# EAGLE design Shield_SEN100T_v4 (EAGLE 5.11)
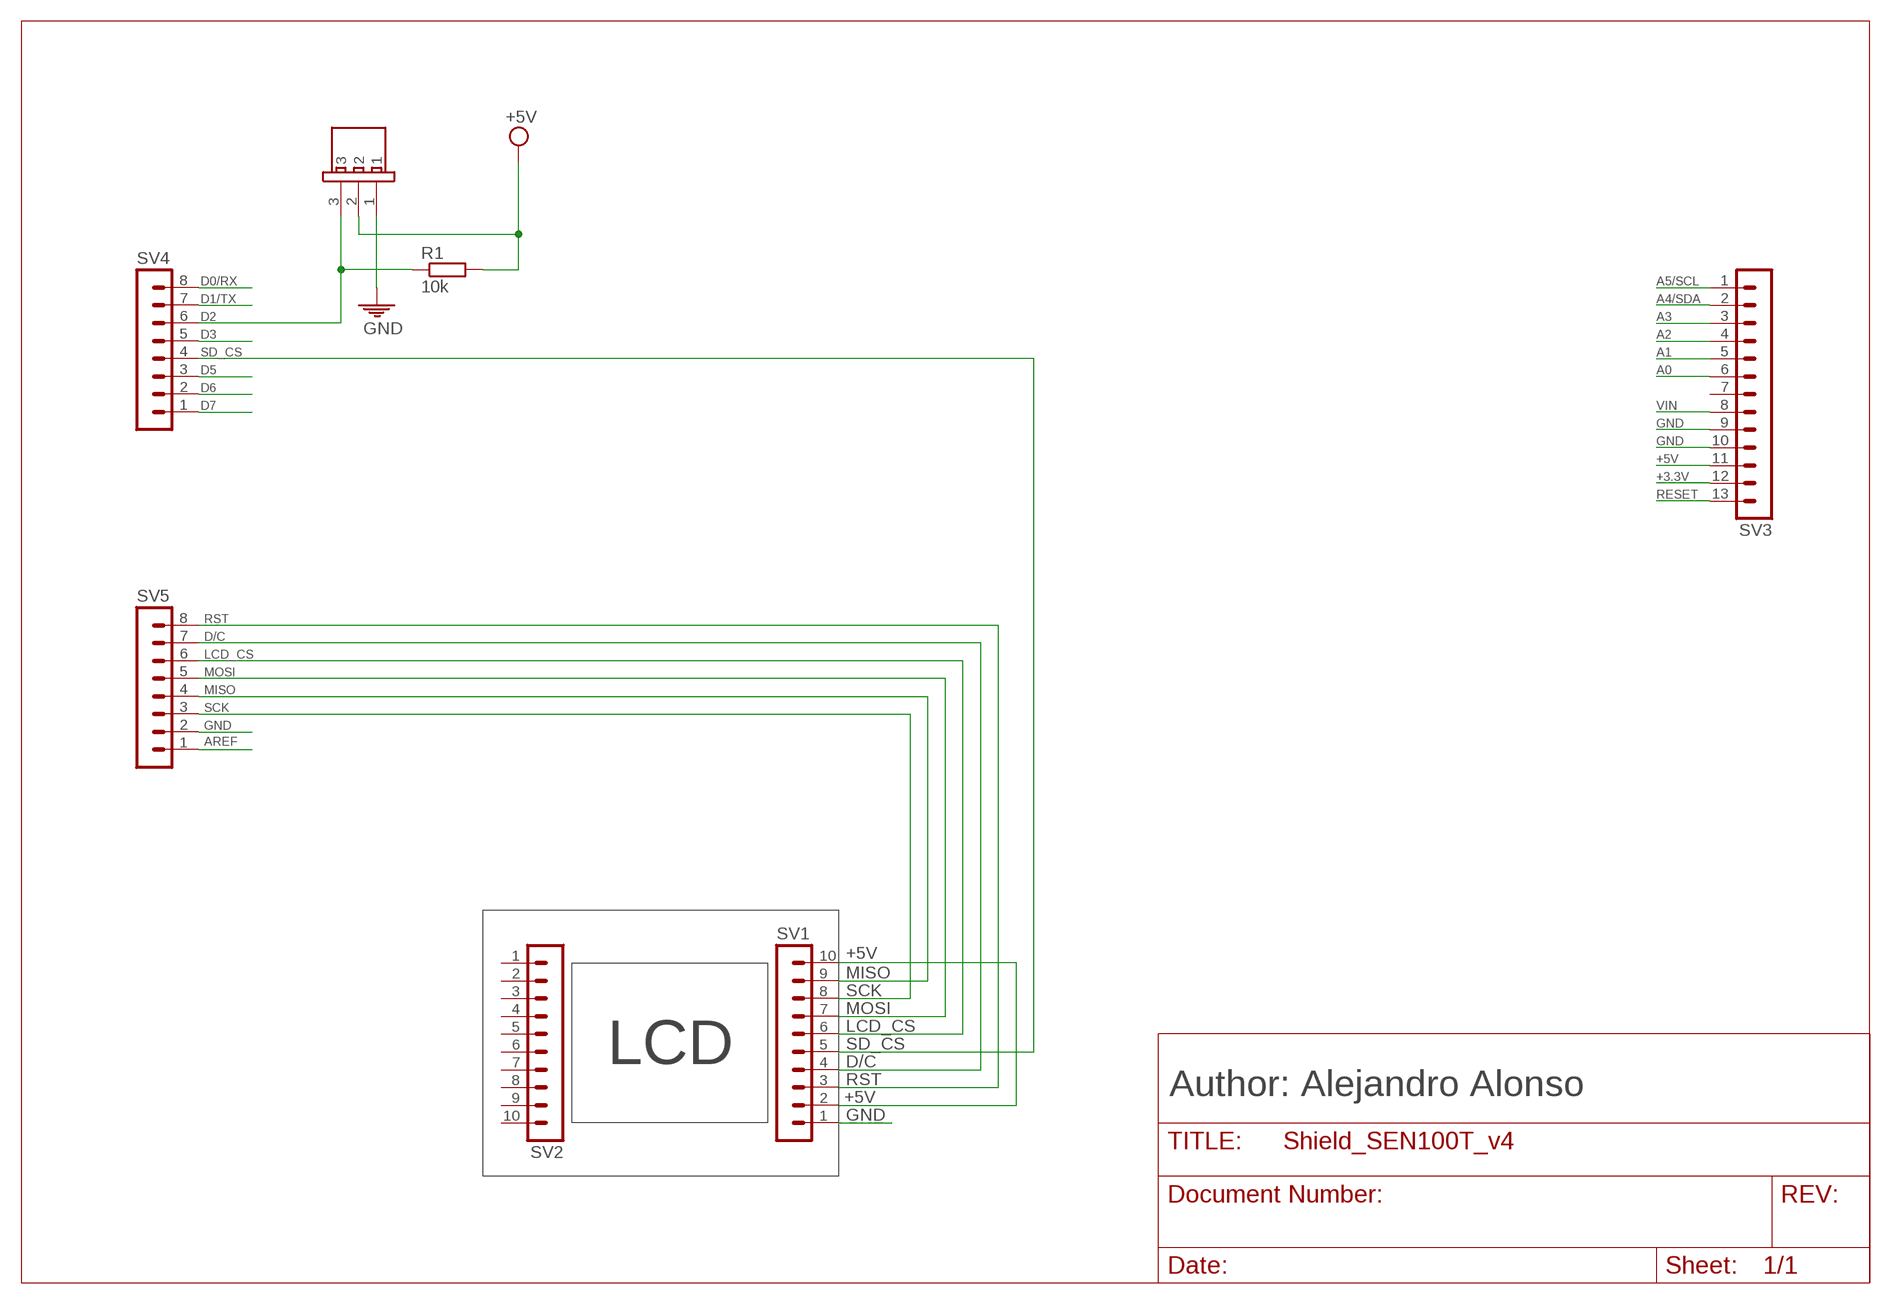
[diagram p0: schematic, sheet 1]

## Parts
1WIRE  CON-POWER-3  [CON-POWER-3]
R1  10k  R-EU_0207/10  [0207/10]
SV1  MA10-1  [MA10-1]
SV2  MA10-1  [MA10-1]
SV3  MA13-1  [MA13-1]
SV4  MA08-1  [MA08-1]
SV5  MA08-1  [MA08-1]

## Nets
+3.3V: SV3.12
+5V: 1WIRE.2 R1.2 SV1.2 SV1.10 SV3.11
A0: SV3.6
A1: SV3.5
A2: SV3.4
A3: SV3.3
A4/SDA: SV3.2
A5/SCL: SV3.1
AREF: SV5.1
D0/RX: SV4.8
D1/TX: SV4.7
D2: 1WIRE.3 R1.1 SV4.6
D3: SV4.5
D5: SV4.3
D6: SV4.2
D7: SV4.1
D/C: SV1.4 SV5.7
GND: 1WIRE.1 SV1.1 SV3.9 SV3.10 SV5.2
LCD_CS: SV1.6 SV5.6
MISO: SV1.9 SV5.4
MOSI: SV1.7 SV5.5
RESET: SV3.13
RST: SV1.3 SV5.8
SCK: SV1.8 SV5.3
SD_CS: SV1.5 SV4.4
VIN: SV3.8
Unconnected: SV2.1 SV2.2 SV2.3 SV2.4 SV2.5 SV2.6 SV2.7 SV2.8 SV2.9 SV2.10 SV3.7

## Notes on the sheet
- LCD
- Author: Alejandro Alonso

## Library data of the parts
1WIRE = IEARobotics:CON-POWER-3
R1 = rcl:R-EU_: RESISTOR, European symbol
SV1 SV2 = con-lstb:MA10-1: PIN HEADER; OC_FARNELL: unknown; OC_NEWARK: unknown
SV3 = con-lstb:MA13-1: PIN HEADER; OC_FARNELL: unknown; OC_NEWARK: unknown
SV4 SV5 = con-lstb:MA08-1: PIN HEADER; OC_FARNELL: unknown; OC_NEWARK: unknown

## Board
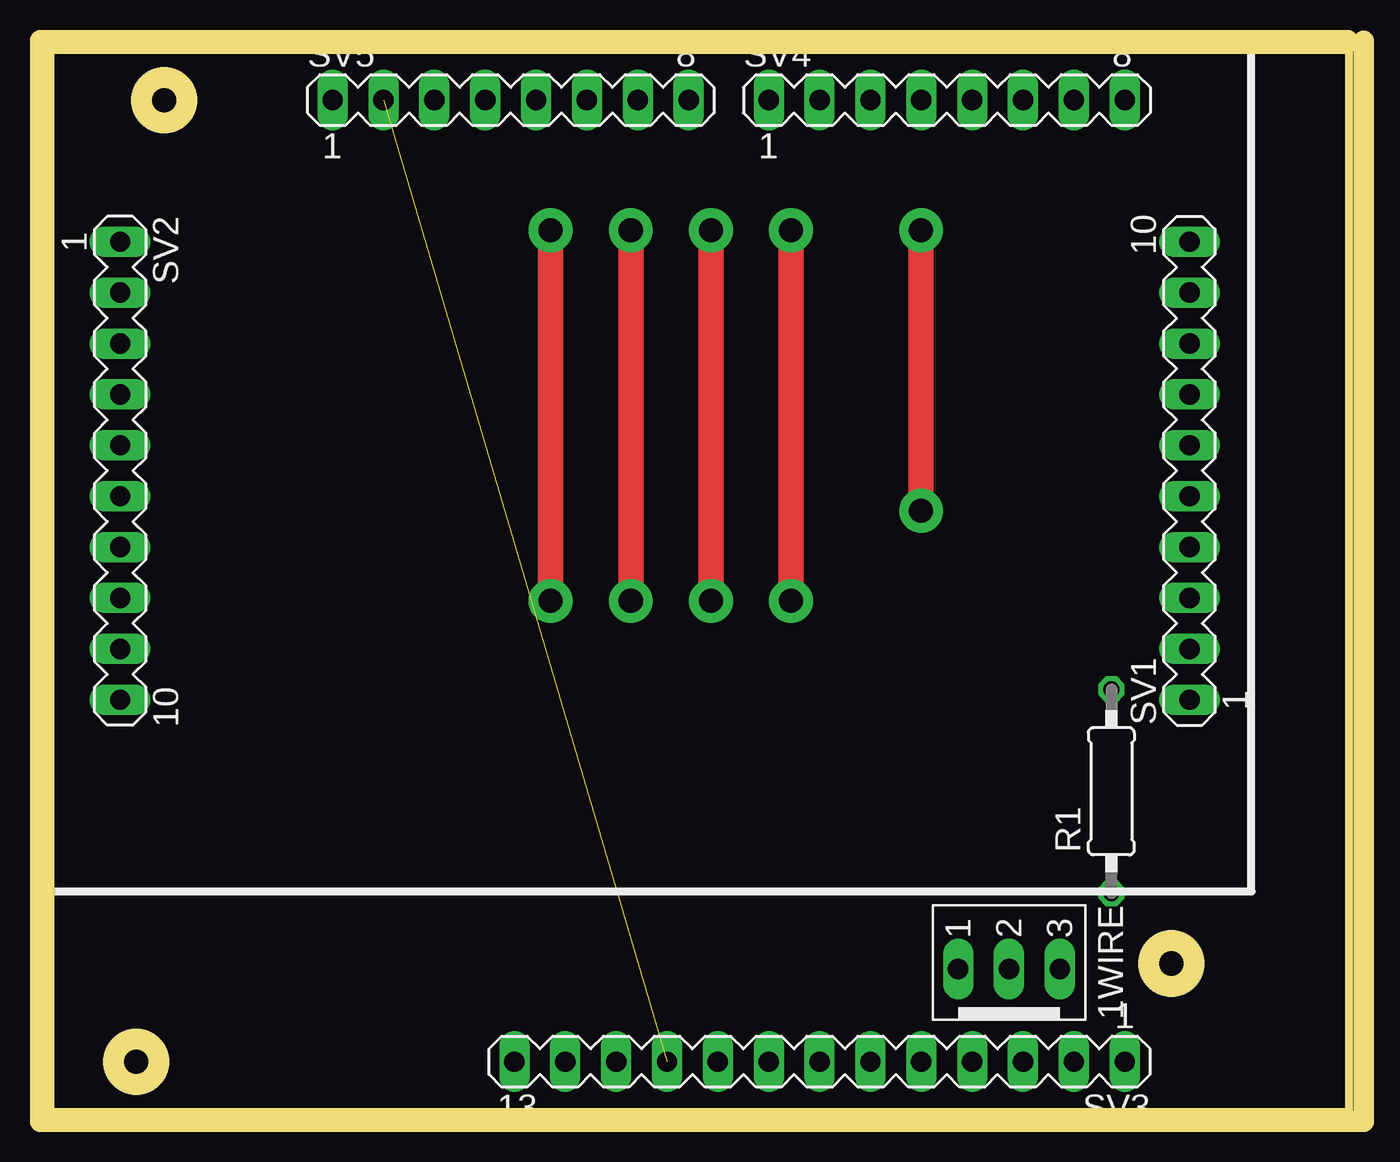
[diagram p1: board, top side]
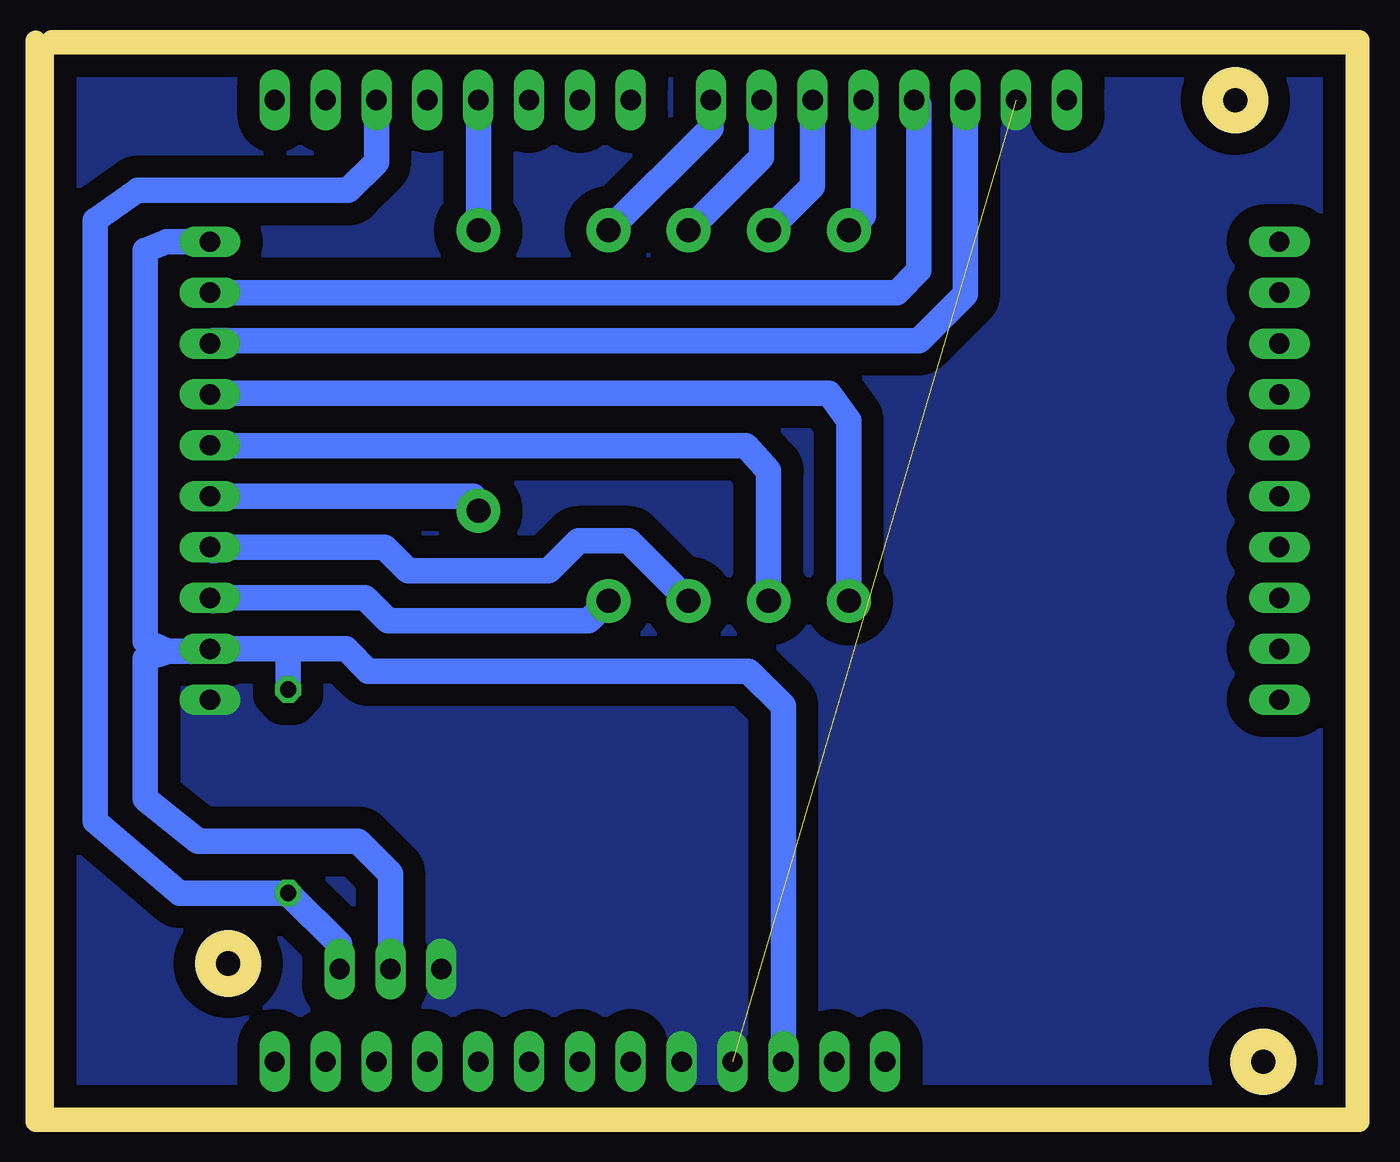
[diagram p2: board, bottom side, seen from below]

Size 64.89 x 53 mm. Coordinates in mm from the lower left corner, seen from the top.
Outline: 0,0 56,0
Outline: 0,0 64.89,0 64.89,53 0,53 0,0
Copper layers (1*16): Top 0.035mm / dielectric 1.5mm / Bottom 0.035mm
Design rules "default *": minimum track width 10mil, minimum drill 24mil, track to track 25mil, track to pad 25mil, pad to pad 25mil, via to via 25mil, smd to smd 8mil, copper to edge 40mil, drill to drill 8mil, minimum pad ring 10mil, minimum via ring 8mil, stop-mask expansion 4mil, vias tented up to drill 0mil, thermal gap 10mil
Holes 3.2 mm at 4.3,2.5 56,7.4 5.7,50.5
Milling: area 3.2,1.4 to 5.4,3.6; area 54.9,6.3 to 57.1,8.5; area 4.6,49.4 to 6.8,51.6; 4 lines

### Footprints (pad centres in the part's own frame; a part is rotated, then mirrored left to right if it is on the bottom)
CON-POWER-3 = drill 1.016 long: 1 0,0; 2 0,2.54; 3 0,5.08
0207/10 = drill 0.813 octagon: 1 -5.08,0; 2 5.08,0
MA10-1 = drill 1.016 long: 1 -11.43,0; 2 -8.89,0; 3 -6.35,0; 4 -3.81,0; 5 -1.27,0; 6 1.27,0; 7 3.81,0; 8 6.35,0; 9 8.89,0; 10 11.43,0
MA13-1 = drill 1.016 long: 1 -15.24,0; 2 -12.7,0; 3 -10.16,0; 4 -7.62,0; 5 -5.08,0; 6 -2.54,0; 7 0,0; 8 2.54,0; 9 5.08,0; 10 7.62,0; 11 10.16,0; 12 12.7,0; 13 15.24,0
MA08-1 = drill 1.016 long: 1 -8.89,0; 2 -6.35,0; 3 -3.81,0; 4 -1.27,0; 5 1.27,0; 6 3.81,0; 7 6.35,0; 8 8.89,0

### Placement (x,y rotation side)
1WIRE  45.35,7.13 270 top
R1  53,16 90 top
SV1  56.9,32 90 top
SV2  3.5,32 270 top
SV3  38.43,2.5 180 top
SV4  44.78,50.5 0 top
SV5  23,50.5 0 top

### Tracks (layer width: path | path; a pad name or v marks a point on that pad's centre or on a via)
+5V
  Bottom 1.27: SV1.10 59.07,43.43 60.13,43 60.13,23.5 59,23 | 59,23 57.01,23 SV1.2 53,23.11 | 59,23 60.13,22.63 60.13,15.63 57.5,13.5 49.5,13.5 47.89,11.89 1WIRE.2 | SV3.11 28.27,20.27 30,22 49,22 50.11,23.11 53,23.11 | 53,23.11 R1.2
A0
  Bottom 1.016: SV3.6 40.93,2.54
A5/SCL
  Bottom 1.016: SV3.1 53.5,2.67
D2
  Bottom 1.27: SV4.6 48.59,47.41 50,46 60.5,46 62.63,44.5 62.63,14.5 58.42,10.92 R1.1 50.43,8.35 1WIRE.3
D/C  (via drill 1.2 pad 2.18)
  Top 1.27: v33,25.5 v33,44
  Bottom 1.27: SV5.7 29.35,47.65 v33,44 | v33,25.5 36,28.5 38.5,28.5 40,27 47,27 48.19,28.19 SV1.4 56.71,28
GND  (1 unrouted)
  pour Bottom (isolate 1.114, rank 6, no thermals): -0.87,53.84 65.79,53.84 65.79,-0.77 -0.87,-0.77
LCD_CS  (via drill 1.2 pad 2.18)
  Top 1.27: v29,25.5 v29,44
  Bottom 1.27: SV5.6 26.81,46.19 v29,44 | v29,25.5 29,32 30.13,33.25 53.63,33.25 54,33.25 56.67,33.25 SV1.6
MISO
  Bottom 1.27: SV1.9 22.61,40.89 21.5,42 21.5,50.27 SV5.4
MOSI  (via drill 1.2 pad 2.18)
  Top 1.27: v25,25.5 v25,44
  Bottom 1.27: SV5.5 24.27,44.73 v25,44 | v25,25.5 25,34.5 26,35.88 56.59,35.88 SV1.7
RST  (via drill 1.2 pad 2.18)
  Top 1.27: v37,25.5 v37,44
  Bottom 1.27: SV5.8 31.89,49.11 v37,44 | 56.75,25.5 SV1.3 49.15,25.65 48,24.5 38,24.5 v37,25.5
SCK
  Bottom 1.27: SV5.3 19.19,40.81 21.5,38.5 56.75,38.5 SV1.8
SD_CS  (via drill 1.2 pad 2.18)
  Top 1.27: v43.5,30 v43.5,44
  Bottom 1.27: SV1.5 43.73,30.73 v43.5,30 | v43.5,44 SV4.4